# EAGLE schematic CircuitoEMitter (EAGLE 7.5.0)
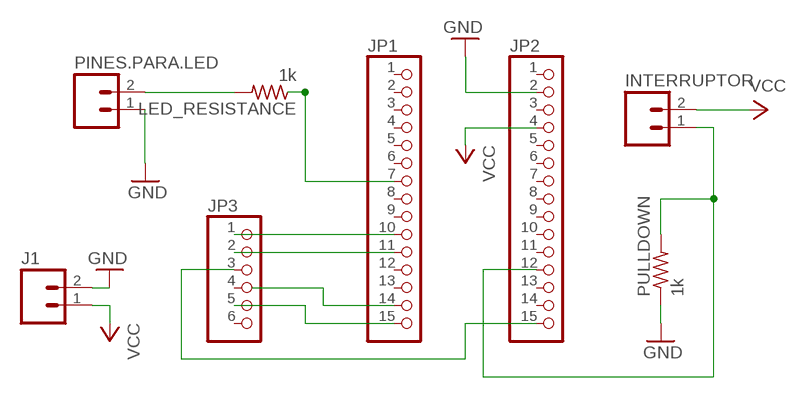
[diagram p0: schematic, sheet 1]

## Parts
INTERRUPTOR  M02LOCK_LONGPADS  [1X02_LOCK_LONGPADS]
J1  M02POGO_PIN_HOLES_ONLY  [1X02_PP_HOLES_ONLY]
JP1  PINHD-1X15-CB  [1X15-CB]
JP2  PINHD-1X15-CB  [1X15-CB]
JP3  PINHD-1X6CLEAN  [1X06-CLEAN]
LED_RESISTANCE  1k  R-US_0204/7  [0204/7]
PINES.PARA.LED  M02LOCK_LONGPADS  [1X02_LOCK_LONGPADS]
PULLDOWN  1k  R-US_0204/7  [0204/7]

## Nets
GND: J1.2 JP2.2 PINES.PARA.LED.1 PULLDOWN.1
N$1: JP1.10 JP3.1
N$2: JP1.11 JP3.2
N$3: JP2.15 JP3.3
N$4: JP1.14
N$5: JP1.15 JP3.5
N$6: INTERRUPTOR.1 JP2.12 PULLDOWN.2
N$8: LED_RESISTANCE.2 PINES.PARA.LED.2
N$9: JP1.7 LED_RESISTANCE.1
VCC: INTERRUPTOR.2 J1.1 JP2.4
Unconnected: JP1.1 JP1.2 JP1.3 JP1.4 JP1.5 JP1.6 JP1.8 JP1.9 JP1.12 JP1.13 JP2.1 JP2.3 JP2.5 JP2.6 JP2.7 JP2.8 JP2.9 JP2.10 JP2.11 JP2.13 JP2.14 JP3.4 JP3.6

## Library data of the parts
INTERRUPTOR J1 PINES.PARA.LED = mecatronica_eagle_lib:M02: Standard 2-pin 0.1" header. Use with - straight break away headers ( PRT-00116) - right angle break away headers (PRT-00553) - swiss pins (PRT-00743) - machine pins (PRT-00117) - female headers (PRT-00115) Molex polarized connector foot print use with: PRT-08233 with associated crimp pins and housings. 2.54_SCREWTERM for use with PRT-10571. 3.5mm Screw Terminal footprints for PRT-08084 5mm Screw Terminal footprints for use with PRT-08432
JP1 JP2 = adafruit:PINHD-1X15: PIN HEADER
JP3 = adafruit:PINHD-1X6: PIN HEADER
LED_RESISTANCE PULLDOWN = adafruit:R-US_: RESISTOR, American symbol

## Net classes
0 default: width 0.305 mm, drill 0.508 mm, clearance 0.254 mm